# EAGLE schematic DMB-4770-4-Analog_4-DAC (EAGLE 6.5.0)
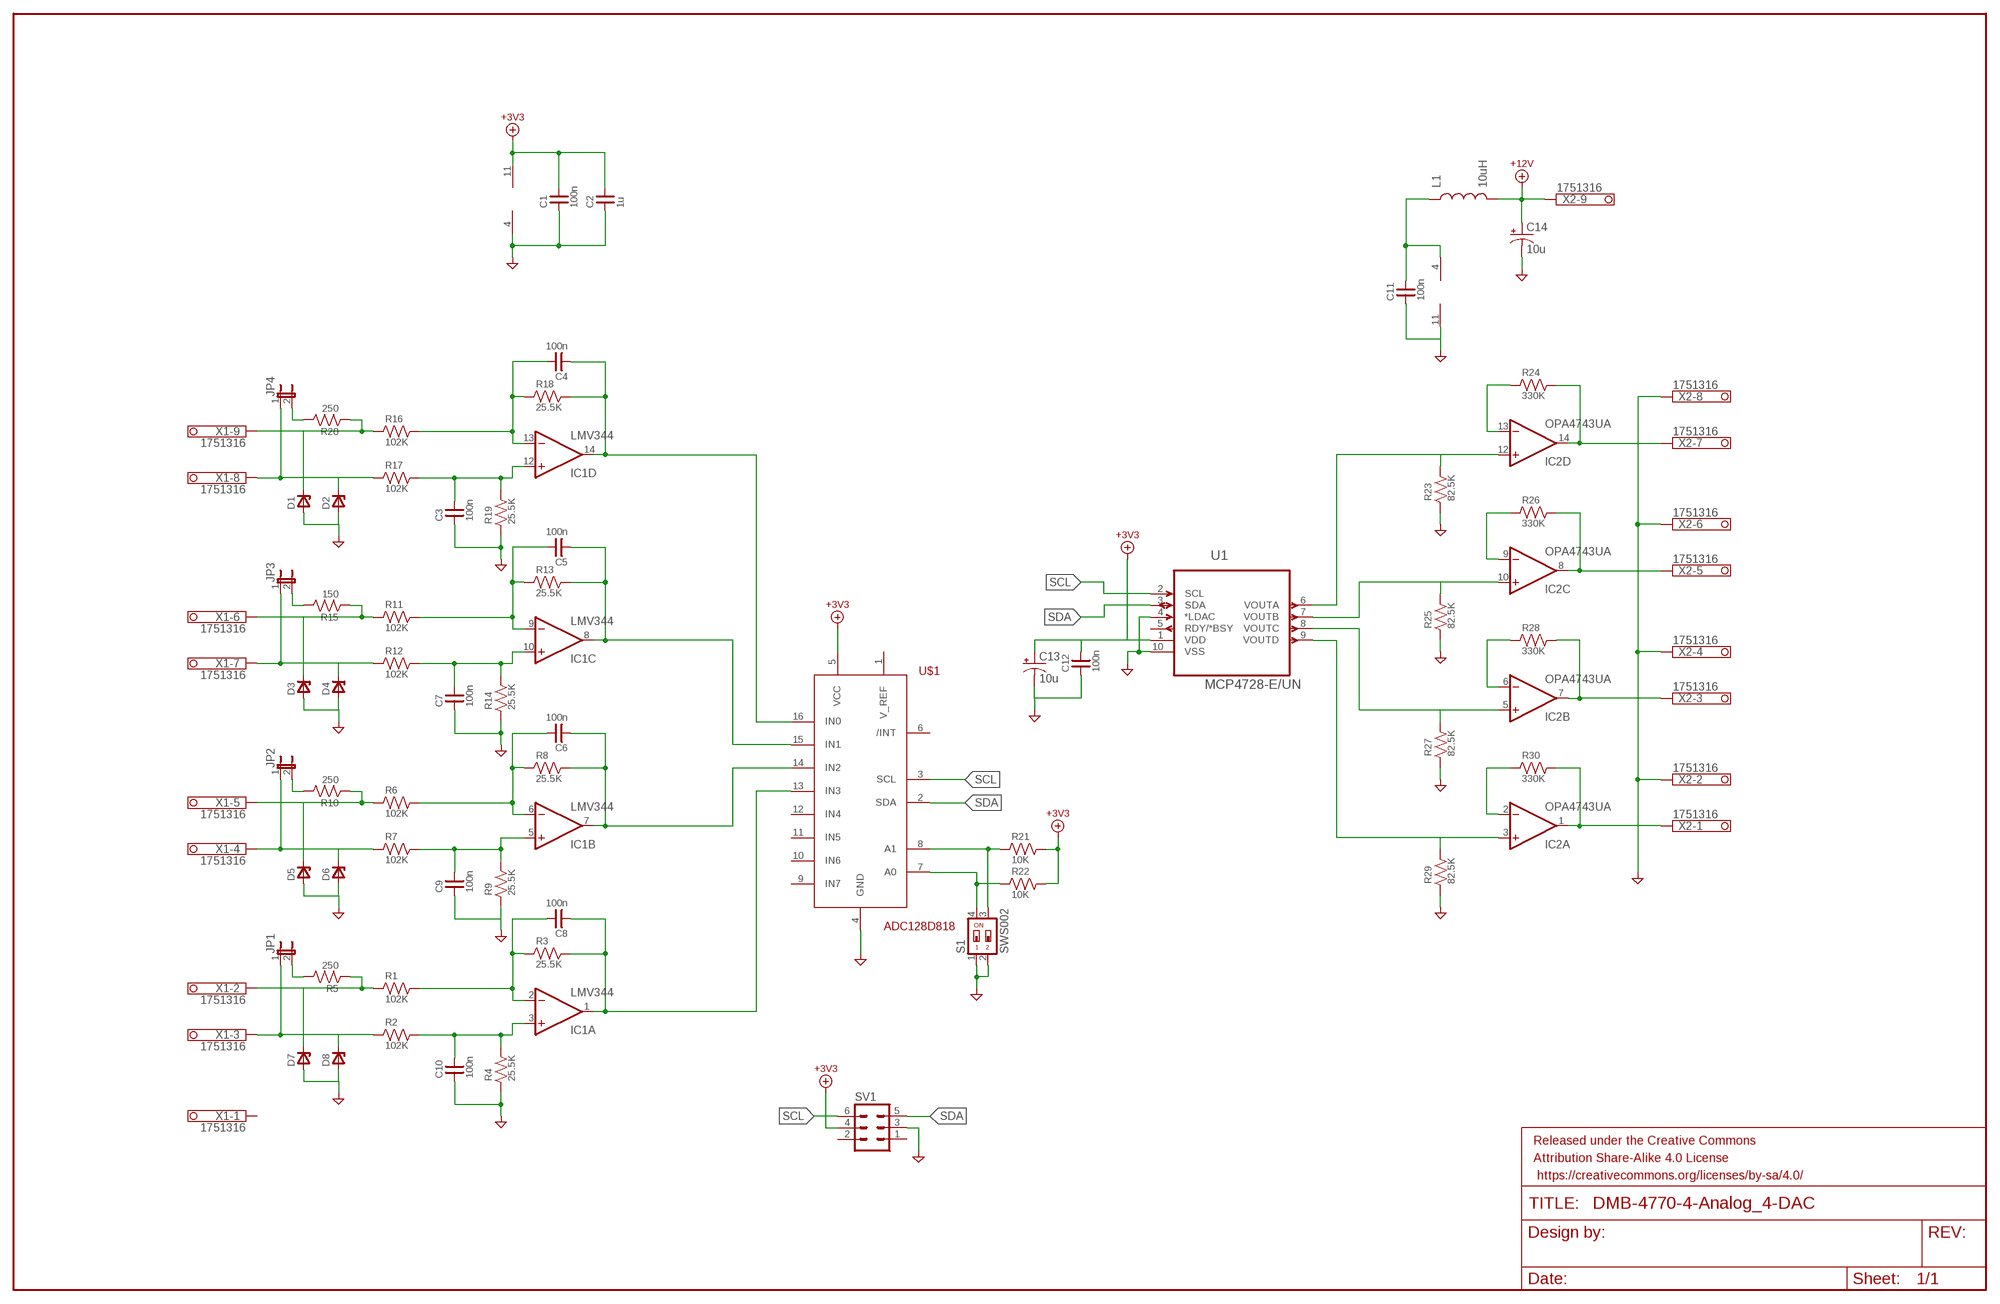
[diagram p0: schematic, sheet 1]

## Parts
C1  100n  C0805  [C0805]
C2  1u  C0805  [C0805]
C3  100n  C0805  [C0805]
C4  100n  C0805  [C0805]
C5  100n  C0805  [C0805]
C6  100n  C0805  [C0805]
C7  100n  C0805  [C0805]
C8  100n  C0805  [C0805]
C9  100n  C0805  [C0805]
C10  100n  C0805  [C0805]
C11  100n  C0805  [C0805]
C12  100n  C0805  [C0805]
C13  10u  CAP_POL1206  [EIA3216]
C14  10u  CAP_POL1206  [EIA3216]
D1  DZS  [DMINIMELF]
D2  DZS  [DMINIMELF]
D3  DZS  [DMINIMELF]
D4  DZS  [DMINIMELF]
D5  DZS  [DMINIMELF]
D6  DZS  [DMINIMELF]
D7  DZS  [DMINIMELF]
D8  DZS  [DMINIMELF]
FRAME1  FRAME-LEDGER  [CREATIVE_COMMONS]
IC1  LMV344  LMV324M  [SO14]
IC2  OPA4743UA  [SO14]
JP1  JP1E  [JP1]
JP2  JP1E  [JP1]
JP3  JP1E  [JP1]
JP4  JP1E  [JP1]
L1  10uH  INDUCTOR0805  [0805]
R1  102K  RU0805  [R0805]
R2  102K  RU0805  [R0805]
R3  25.5K  RU0805  [R0805]
R4  25.5K  RU0805  [R0805]
R5  250  RU0805  [R0805]
R6  102K  RU0805  [R0805]
R7  102K  RU0805  [R0805]
R8  25.5K  RU0805  [R0805]
R9  25.5K  RU0805  [R0805]
R10  250  RU0805  [R0805]
R11  102K  RU0805  [R0805]
R12  102K  RU0805  [R0805]
R13  25.5K  RU0805  [R0805]
R14  25.5K  RU0805  [R0805]
R15  150  RU0805  [R0805]
R16  102K  RU0805  [R0805]
R17  102K  RU0805  [R0805]
R18  25.5K  RU0805  [R0805]
R19  25.5K  RU0805  [R0805]
R20  250  RU0805  [R0805]
R21  10K  RU0805  [R0805]
R22  10K  RU0805  [R0805]
R23  82.5K  RU0805  [R0805]
R24  330K  RU0805  [R0805]
R25  82.5K  RU0805  [R0805]
R26  330K  RU0805  [R0805]
R27  82.5K  RU0805  [R0805]
R28  330K  RU0805  [R0805]
R29  82.5K  RU0805  [R0805]
R30  330K  RU0805  [R0805]
S1  SWS002  [SMS-002]
SV1  ML6  [ML6]
U1  MCP4728-E/UN  [SOP50P490X110-10N]
U$1  ADC128D818  [SSOP16]
X1  1751316  [1751316]
X2  1751316  [1751316]

## Nets
+3V3: C1.2 C2.2 C12.2 C13.A(+) IC1.11(P:V-) R21.2 R22.2 SV1.4 U1.1(VDD) U$1.5(VCC) ; supply symbol labelled V+3V3
+12V: C14.A(+) L1.2 X2.9 ; supply symbol labelled V+12V
DGND: C1.1 C2.1 C3.1 C7.1 C9.1 C10.1 C11.1 C12.1 C13.C(-) C14.C(-) D1.A D2.A D3.A D4.A D5.A D6.A D7.A D8.A IC1.4(P:V+) IC2.11(P:V-) R4.1 R9.1 R14.1 R19.1 R23.1 R25.1 R27.1 R29.1 S1.1 S1.2 SV1.3 U1.4(*LDAC) U1.10(VSS) U$1.4(GND) X2.2 X2.4 X2.6 X2.8 ; supply symbol labelled VDG
N$1: C8.2 IC1.2(A:-IN) R1.2 R3.1
N$2: C10.2 IC1.3(A:+IN) R2.2 R4.2
N$3: C8.1 IC1.1(A:OUT) R3.2 U$1.13(IN3)
N$4: JP1.1 R2.1 X1.3
N$5: C6.2 IC1.6(B:-IN) R6.2 R8.1
N$6: JP1.2 R5.2
N$7: R1.1 R5.1 X1.2
N$8: C9.2 IC1.5(B:+IN) R7.2 R9.2
N$9: C6.1 IC1.7(B:OUT) R8.2 U$1.14(IN2)
N$10: JP2.1 R7.1 X1.4
N$11: JP2.2 R10.2
N$12: R6.1 R10.1 X1.5
N$13: C5.2 IC1.9(C:-IN) R11.2 R13.1
N$14: C7.2 IC1.10(C:+IN) R12.2 R14.2
N$15: C5.1 IC1.8(C:OUT) R13.2 U$1.15(IN1)
N$16: JP3.1 R12.1 X1.7
N$17: JP3.2 R15.2
N$18: R11.1 R15.1 X1.6
N$19: C4.2 IC1.13(D:-IN) R16.2 R18.1
N$20: C3.2 IC1.12(D:+IN) R17.2 R19.2
N$21: C4.1 IC1.14(D:OUT) R18.2 U$1.16(IN0)
N$22: D2.C JP4.1 R17.1 X1.8
N$23: JP4.2 R20.2
N$24: D1.C R16.1 R20.1 X1.9
N$25: U$1.3(SCL)
N$26: U$1.2(SDA)
N$27: IC2.3(A:+IN) R29.2 U1.9(VOUTD)
N$29: IC2.2(A:-IN) R30.1
N$30: IC2.1(A:OUT) R30.2 X2.1
N$31: IC2.7(B:OUT) R28.2 X2.3
N$32: IC2.6(B:-IN) R28.1
N$33: D4.C
N$34: IC2.5(B:+IN) R27.2 U1.8(VOUTC)
N$35: IC2.10(C:+IN) R25.2 U1.7(VOUTB)
N$36: IC2.12(D:+IN) R23.2 U1.6(VOUTA)
N$37: D3.C
N$38: R22.1 S1.4 U$1.7(A0)
N$39: R21.1 S1.3 U$1.8(A1)
N$40: D6.C
N$41: IC2.9(C:-IN) R26.1
N$42: D5.C
N$43: IC2.14(D:OUT) R24.2 X2.7
N$44: IC2.13(D:-IN) R24.1
N$45: U1.2(SCL)
N$46: U1.3(SDA)
N$47: IC2.8(C:OUT) R26.2 X2.5
N$48: C11.2 IC2.4(P:V+) L1.1
N$49: D8.C
N$50: D7.C
SCL: SV1.6
SDA: SV1.5
Unconnected: SV1.1 SV1.2 U1.5(RDY/*BSY) U$1.1(V_REF) U$1.6(/INT) U$1.9(IN7) U$1.10(IN6) U$1.11(IN5) U$1.12(IN4) X1.1

## Library data of the parts
C1-C12 = divers:C: Capacitor bipolar
C13 C14 = SparkFun-Passives:CAP_POL: Capacitor Polarized These are standard SMD and PTH capacitors. Normally 10uF, 47uF, and 100uF in electrolytic and tantalum varieties. Always verify the external diameter of the through hole cap, it varies with capacity, voltage, and manufacturer. The EIA devices should be standard.
D1-D8 = diodes:DZ: Zener diode
FRAME1 = SparkFun-Aesthetics:FRAME-LEDGER: Schematic Frame Standard 11x14 US Ledger frame
IC1 = linear:LMV324?*: Quad General Purpose, Low Voltage, Rail-to-Rail Output Operational Amplifiers Source: http://www.national.com/mpf/LM/LMV321.html http://www.national.com/dt/lmv_qual.pdf
IC2 = linear:OPA4743: 12V, 7MHz, CMOS, Rail-to-Rail I/O Quad OP AMP Source: http://focus.ti.com/lit/ds/sbos201/sbos201.pdf
JP1-JP4 = jumper:JP1E: JUMPER
L1 = SparkFun-Passives:INDUCTOR: Inductors Basic Inductor/Choke - 0603 and 1206. Footprints are not proven and vary greatly between part numbers. SRN6045- 33uH, 20% 1.4A SDR0403-560KL - 56uH, 10%, 500mA RMS/740mA peak
R1-R30 = divers:RU: Resistor, US symbol
S1 = smd-special:SWS002: SMD Dip Switch 2 pol.
SV1 = con-harting-ml:ML6: HARTING; OC_FARNELL: unknown; OC_NEWARK: unknown
U1 = Microchip_By_element14_Batch_1:MCP4728-E/UN: IC, DAC, 12BIT, QUAD; MPN: MCP4728-E/UN; OC_FARNELL: 1800217; OC_NEWARK: 08R1808; PACKAGE: MSOP-10; SUPPLIER: MICROCHIP
U$1 = linear:ADC128D818
X1 X2 = con-phoenix-350:1751316: MKDS 1/ 9-3,5 Printklemme Nennstrom: 10 A Bemessungsspannung: 160 V Raster: 3,5 mm Polzahl: 9 Montageart: Löten Anschlussart: Schraubanschluss Anschlussrichtung vom Leiter zur Platine: 0° Source: http://eshop.phoenixcontact.com .. 1751316.pdf; OC_FARNELL: unknown; OC_NEWARK: unknown